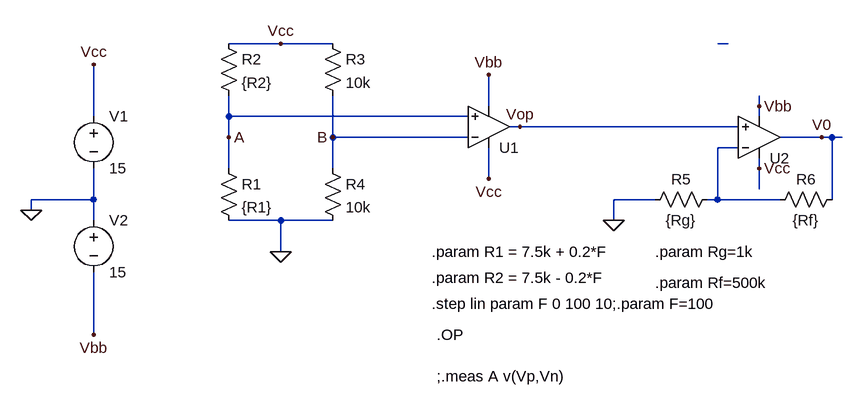
[diagram p0: schematic sensore push pull resistivo half bridge - INA.asc]
sensore push pull resistivo half bridge - INA.asc, the LTspice schematic file:
Version 4.1
SHEET 1 1208 680
WIRE 176 64 96 64
WIRE 256 64 176 64
WIRE 864 64 848 64
WIRE 496 160 496 112
WIRE 912 160 912 144
WIRE -112 176 -112 96
WIRE 96 176 96 144
WIRE 464 176 96 176
WIRE 912 176 912 160
WIRE 544 192 528 192
WIRE 880 192 544 192
WIRE 96 208 96 176
WIRE 256 208 256 144
WIRE 464 208 256 208
WIRE 1008 208 944 208
WIRE 1024 208 1008 208
WIRE 1040 208 1024 208
WIRE 880 224 848 224
WIRE 96 256 96 208
WIRE 256 256 256 208
WIRE 912 256 912 240
WIRE 496 272 496 224
WIRE 912 288 912 256
WIRE -112 304 -112 256
WIRE -112 304 -208 304
WIRE 752 304 688 304
WIRE 848 304 848 224
WIRE 848 304 832 304
WIRE 944 304 848 304
WIRE 1024 304 1024 208
WIRE -208 320 -208 304
WIRE -112 336 -112 304
WIRE 176 336 96 336
WIRE 256 336 176 336
WIRE 688 336 688 304
WIRE 176 384 176 336
WIRE -112 512 -112 416
FLAG 176 384 0
FLAG -208 320 0
FLAG -112 96 Vcc
FLAG 176 64 Vcc
FLAG -112 512 Vbb
FLAG 496 112 Vbb
FLAG 496 272 Vcc
FLAG 544 192 Vop
FLAG 96 208 A
FLAG 256 208 B
FLAG 688 336 0
FLAG 912 160 Vbb
FLAG 912 256 Vcc
FLAG 1008 208 V0
DATAFLAG 1040 208 ""
DATAFLAG 704 192 ""
SYMBOL OpAmps\\UniversalOpAmp 496 192 M180
SYMATTR InstName U1
SYMATTR Value2 Avol=1 GBW=10Meg Vos=0
SYMBOL res 80 240 R0
SYMATTR InstName R1
SYMATTR Value {R1}
SYMBOL res 80 48 R0
SYMATTR InstName R2
SYMATTR Value {R2}
SYMBOL res 240 48 R0
SYMATTR InstName R3
SYMATTR Value 10k
SYMBOL res 240 240 R0
SYMATTR InstName R4
SYMATTR Value 10k
SYMBOL voltage -112 160 R0
WINDOW 123 0 0 Left 0
WINDOW 39 0 0 Left 0
SYMATTR InstName V1
SYMATTR Value 15
SYMBOL voltage -112 320 R0
WINDOW 123 0 0 Left 0
WINDOW 39 0 0 Left 0
SYMATTR InstName V2
SYMATTR Value 15
SYMBOL OpAmps\\UniversalOpAmp 912 208 M180
SYMATTR InstName U2
SYMBOL res 848 288 R90
WINDOW 0 0 56 VBottom 2
WINDOW 3 32 56 VTop 2
SYMATTR InstName R5
SYMATTR Value {Rg}
SYMBOL res 1040 288 R90
WINDOW 0 0 56 VBottom 2
WINDOW 3 32 56 VTop 2
SYMATTR InstName R6
SYMATTR Value {Rf}
TEXT 408 384 Left 2 !.param R1 = 7.5k + 0.2*F
TEXT 408 424 Left 2 !.param R2 = 7.5k - 0.2*F
TEXT 408 464 Left 2 !.step lin param F 0 100 10;.param F=100
TEXT 416 512 Left 2 !.OP
TEXT 752 384 Left 2 !.param Rg=1k
TEXT 752 432 Left 2 !.param Rf=500k
TEXT 416 576 Left 2 !;.meas A v(Vp,Vn)

The netlist it stands for:
* sensore push pull resistivo half bridge - INA.asc
X§U1 A B Vcc Vbb Vop level1 Avol=1 GBW=10Meg Vos=0 En=0 Enk=0 In=0 Ink=0 Rin=500Meg  ; pins In+ In- V+ V- OUT
R1 A 0 {R1}
R2 Vcc A {R2}
R3 Vcc B 10k
R4 B 0 10k
V1 Vcc 0 15
V2 0 Vbb 15
X§U2 Vop N002 Vcc Vbb V0 level1 Avol=1Meg GBW=10Meg Vos=0 En=0 Enk=0 In=0 Ink=0 Rin=500Meg  ; pins In+ In- V+ V- OUT
R5 N002 0 {Rg}
R6 V0 N002 {Rf}
.param R1 = 7.5k + 0.2*F
.param R2 = 7.5k - 0.2*F
.step lin param F 0 100 10;.param F=100
.OP
.param Rg=1k
.param Rf=500k
;.meas A v(Vp,Vn)
.lib UniversalOpAmp1.lib
.backanno
.end